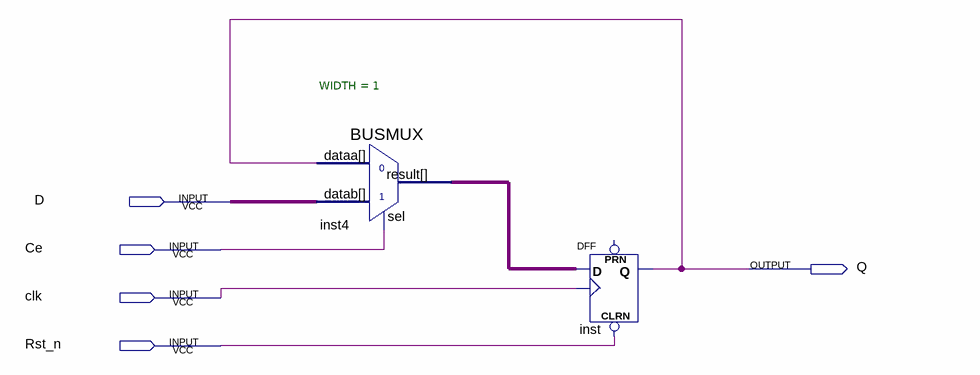
[diagram p0: schematic sheet]
// Quartus schematic practice2.bdf as structural Verilog: 2 symbols, 5 pins
module practice2 (
  input  D,
  input  Ce,
  input  clk,
  input  Rst_n,
  output Q
);

  wire inst4_result;

  BUSMUX #(.WIDTH(1)) inst4 (.datab(D), .sel(Ce), .dataa(Q), .result(inst4_result));
  DFF inst (.CLRN(Rst_n), .CLK(clk), .D(inst4_result), .Q(Q));  // open: PRN
endmodule
